# Altium project uStepperS.PrjPcb
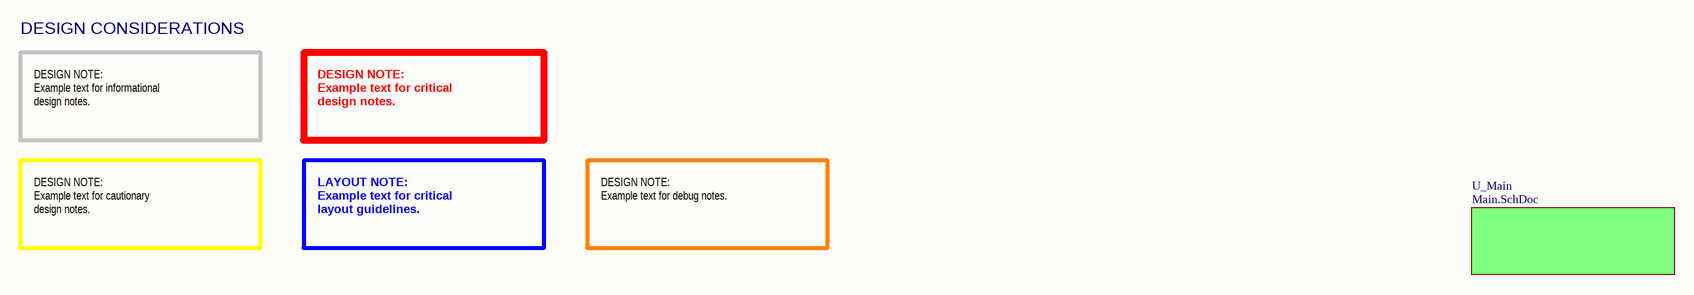
[diagram p0: Coverpage.SchDoc]
GlobalCompanyName: ON Development; GlobalDrawnBy: Mogens Groth Nicolaisen; GlobalProjectName: uStepper S; GlobalProjectRevision: 1.0
7 sheets, 108 parts. Net scope: hierarchical (ports join the sheet entries above them; power ports are global).
Board file: uStepper.PcbDoc
Sheets:
  Coverpage.SchDoc
    U_Main = Main.SchDoc
      U_encoder = encoder.SchDoc
      U_Power = Power.SchDoc
      U_Stepper_control = Stepper_control.SchDoc
      U_USB = USB.SchDoc
      U_MCU+IO = MCU+IO.SchDoc

## Sheet Coverpage.SchDoc: uStepper S
size A3; DrawnBy: Mogens Groth Nicolaisen; DocumentNumber: 1; SheetNumber: 1; SheetTotal: 7

### Sub-sheets
U_Main = Main.SchDoc: no entries

### Notes on the sheet
- DESIGN CONSIDERATIONS
- DESIGN NOTE:
  Example text for informational
  design notes.
- DESIGN NOTE:
  Example text for critical
  design notes.
- DESIGN NOTE:
  Example text for cautionary
  design notes.
- LAYOUT NOTE:
  Example text for critical
  layout guidelines.
- DESIGN NOTE:
  Example text for debug notes.
- ON Development
- Title:
- Size:
- A3
- Drawn By:
- Date:
- Sheet
- of
- Revision:

## Sheet Main.SchDoc: Main
size A3; DrawnBy: Mogens Groth Nicolaisen; DocumentNumber: 2; Revision: 1.0; SheetNumber: 2; SheetTotal: 7
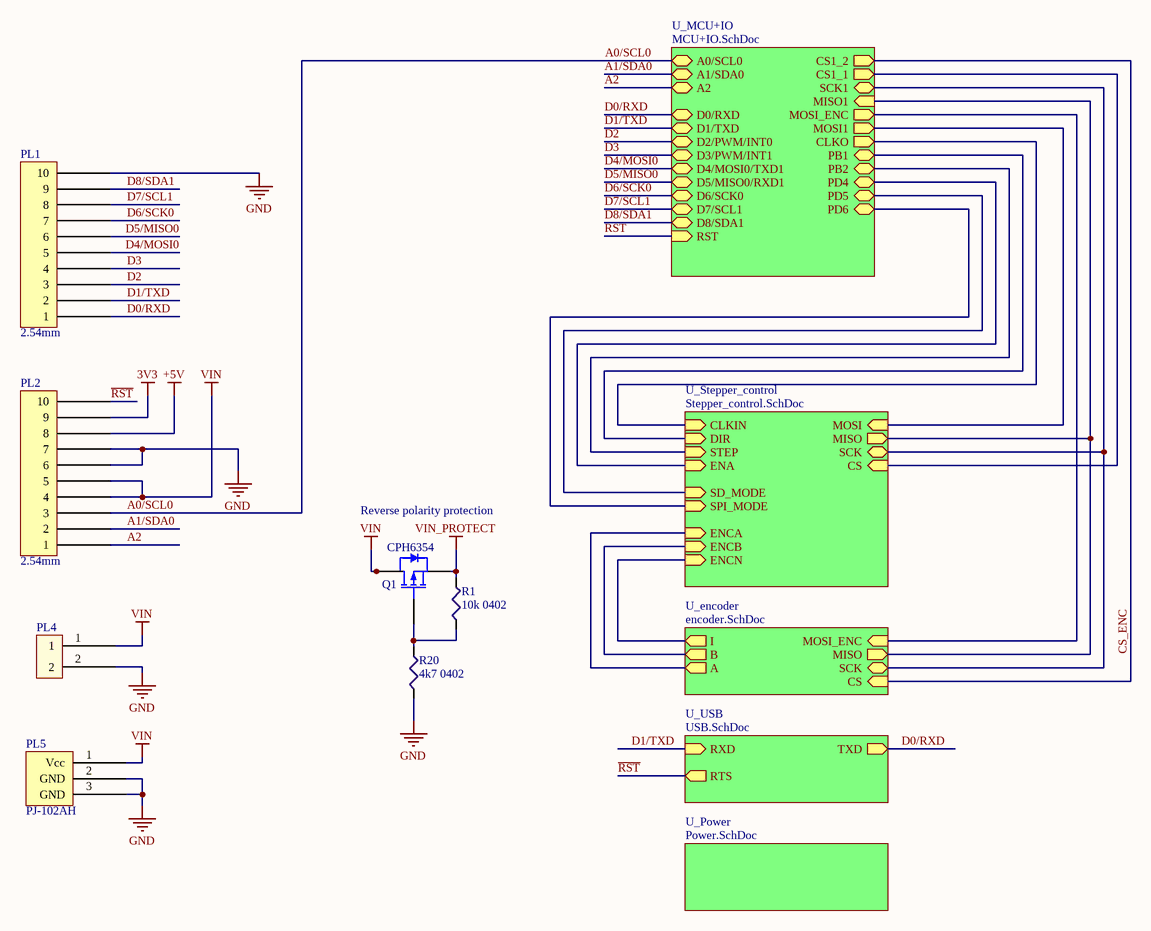
[diagram p1: Main.SchDoc]

### Parts
PL1  2.54mm  [10-pin female 2.54mm]
PL2  2.54mm  [10-pin female 2.54mm]
PL4  2pin Terminal block 5.08mm  [5mm header]  (value not drawn)
PL5  PJ-102AH  [PJ-102AH]
Q1  CPH6354  [SOT95P280X95-6N]
R1  10k 0402  [RES_0402]
R20  4k7 0402  [RES_0402]

### Sub-sheets
U_encoder = encoder.SchDoc: MISO (out), MOSI_ENC (in), SCK (bidir), CS (in), A (out), B (out), I (out)
U_MCU+IO = MCU+IO.SchDoc: A0/SCL0 (bidir), A1/SDA0 (bidir), A2 (bidir), MOSI_ENC (out), D1/TXD (bidir), D0/RXD (bidir), PB2 (bidir), D4/MOSI0/TXD1 (bidir), D5/MISO0/RXD1 (bidir), D6/SCK0 (bidir), SCK1 (bidir), MISO1 (in), MOSI1 (out), CS1_1 (out), CLKO (out), D8/SDA1 (bidir), D7/SCL1 (bidir), D3/PWM/INT1 (bidir), D2/PWM/INT0 (bidir), PD5 (bidir), PD6 (bidir), PD4 (bidir), PB1 (bidir), CS1_2 (out), RST (in)
U_Power = Power.SchDoc: no entries
U_Stepper_control = Stepper_control.SchDoc: STEP (in), DIR (in), CS (in), SCK (bidir), MOSI (in), MISO (out), ENCN (in), ENCA (in), ENCB (in), SPI_MODE (in), SD_MODE (in), ENA (in), CLKIN (in)
U_USB = USB.SchDoc: RXD (in), TXD (out), RTS (out)

### Nets
3V3: PL2.9
+5V: PL2.8
GND: PL1.10 PL2.6 PL2.7 PL4.2 PL5.2(GND) PL5.3(GND) R20.1
VIN: PL2.4 PL2.5 PL4.1 PL5.1(Vcc) Q1.1(DRAIN) Q1.2(DRAIN) Q1.5(DRAIN) Q1.6(DRAIN)
VIN_PROTECT: Q1.4(SOURCE) R1.2
~{RST}: PL2.10 ; sheet U_USB/RTS, sheet U_MCU+IO/RST
A: sheet U_encoder/A, sheet U_Stepper_control/ENCA
A0/SCL0: PL2.3 ; sheet U_MCU+IO/A0/SCL0
A1/SDA0: PL2.2 ; sheet U_MCU+IO/A1/SDA0
A2: PL2.1 ; sheet U_MCU+IO/A2
B: sheet U_encoder/B, sheet U_Stepper_control/ENCB
CLKIN: sheet U_Stepper_control/CLKIN, sheet U_MCU+IO/CLKO
CS: sheet U_Stepper_control/CS, sheet U_MCU+IO/CS1_1
CS_ENC: sheet U_encoder/CS, sheet U_MCU+IO/CS1_2
D0/RXD: PL1.1 ; sheet U_USB/TXD, sheet U_MCU+IO/D0/RXD
D1/TXD: PL1.2 ; sheet U_USB/RXD, sheet U_MCU+IO/D1/TXD
D2: PL1.3 ; sheet U_MCU+IO/D2/PWM/INT0
D3: PL1.4 ; sheet U_MCU+IO/D3/PWM/INT1
D4/MOSI0: PL1.5 ; sheet U_MCU+IO/D4/MOSI0/TXD1
D5/MISO0: PL1.6 ; sheet U_MCU+IO/D5/MISO0/RXD1
D6/SCK0: PL1.7 ; sheet U_MCU+IO/D6/SCK0
D7/SCL1: PL1.8 ; sheet U_MCU+IO/D7/SCL1
D8/SDA1: PL1.9 ; sheet U_MCU+IO/D8/SDA1
DIR: sheet U_Stepper_control/DIR, sheet U_MCU+IO/PB1
ENA: sheet U_Stepper_control/ENA, sheet U_MCU+IO/PD4
ENCN: sheet U_encoder/I, sheet U_Stepper_control/ENCN
MISO: sheet U_encoder/MISO, sheet U_Stepper_control/MISO, sheet U_MCU+IO/MISO1
MOSI: sheet U_Stepper_control/MOSI, sheet U_MCU+IO/MOSI1
MOSI_ENC: sheet U_encoder/MOSI_ENC, sheet U_MCU+IO/MOSI_ENC
PB2: sheet U_Stepper_control/STEP, sheet U_MCU+IO/PB2
PD5: sheet U_Stepper_control/SD_MODE, sheet U_MCU+IO/PD5
PD6: sheet U_Stepper_control/SPI_MODE, sheet U_MCU+IO/PD6
SCK: sheet U_encoder/SCK, sheet U_Stepper_control/SCK, sheet U_MCU+IO/SCK1
NetQ1_3: Q1.3(GATE) R1.1 R20.2

### Notes on the sheet
- Reverse polarity protection
- ON Development
- Title:
- Size:
- A3
- Drawn By:
- Date:
- Sheet
- of
- Revision:

### Library data of the parts
PL1 PL2 = CMP-003-0004-2: Pin header 10-pin 2.54mm female; Mfg. Part Number: DS1023-1*10S21
PL4 = CMP-003-0002-2: PCB terminal block, angled 90°; 5mm, 2-way, 1.5mm2; Mfg. Part Number: DG301-5.0-02P-11-00A(H)
PL5 = CMP-003-0001-3: CONN PWR JACK 2X5.5MM SOLDER; Mfg. Part Number: PJ-102AH
Q1 = CMP-014-0006-2: MOSFET P-CH 60V 4A CPH6; Mfg. Part Number: CPH6354-TL-W
R1 = CMP-001-0019-3: RES SMD 10K OHM 1% 1/16W 0402; Mfg. Part Number: RMCF0402FT10K0; Case/Package: 0402; Power: 1/16 W; Tolerance: 1 %; Value: 10k
R20 = CMP-001-0029-3: RES SMD 4.7K OHM 1% 1/16W 0402; Mfg. Part Number: RC1005F472CS; Tolerance: 1; Case/Package: 0402; Power: 1/16W; Value: 4k7

## Sheet encoder.SchDoc: Encoder
size A3; DrawnBy: Mogens Groth Nicolaisen; DocumentNumber: 7; Revision: 1.0; SheetNumber: 7; SheetTotal: 7
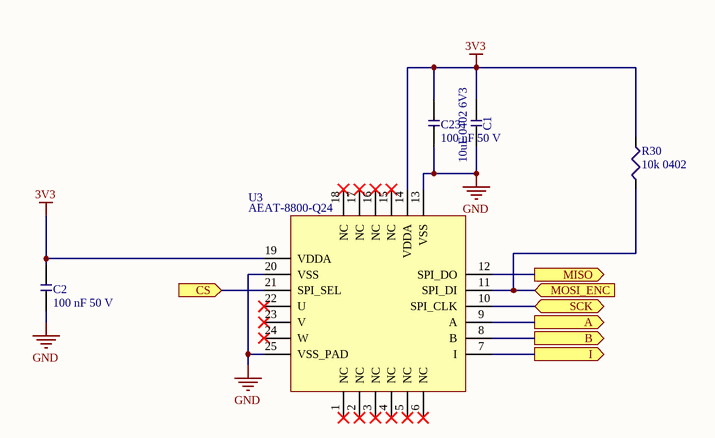
[diagram p2: encoder.SchDoc]

### Parts
C1  10uF 0402 6V3  [CAP_0402]
C2  100 nF 50 V  [CAP_0402]
C23  100 nF 50 V  [CAP_0402]
R30  10k 0402  [RES_0402]
U3  AEAT-8800-Q24  [AEAT-8800-Q24]

### Ports
A (out), B (out), CS (in), I (out), MISO (out), MOSI_ENC (in), SCK (bidir)

### Nets
3V3: C1.2 C2.1 C23.1 R30.2 U3.14(VDDA) U3.19(VDDA)
GND: C1.1 C2.2 C23.2 U3.13(VSS) U3.20(VSS) U3.25(VSS_PAD)
A: U3.9(A) ; port A
B: U3.8(B) ; port B
CS_ENC: U3.21(SPI_SEL) ; port CS
ENCN: U3.7(I) ; port I
MISO: U3.12(SPI_DO) ; port MISO
MOSI_ENC: R30.1 U3.11(SPI_DI) ; port MOSI_ENC
SCK: U3.10(SPI_CLK) ; port SCK

Not connected (* = marked no-connect by the designer): U3 1(NC)* 2(NC)* 3(NC)* 4(NC)* 5(NC)* 6(NC)* 15(NC)* 16(NC)* 17(NC)* 18(NC)* 22(U)* 23(V)* 24(W)*

### Notes on the sheet
- ON Development
- Title:
- Size:
- A3
- Drawn By:
- Date:
- Sheet
- of
- Revision:

### Library data of the parts
C1 = CMP-00011-3: 10uF 20% 0402 6V3 X6S; Current Rating: -; Tolerance: 20%; Value: 10uF; Voltage: 6V3
C2 C23 = CMP-00088-2: Multilayer Ceramic Capacitors MLCC - SMD/SMT .1uF 50Volts X7R +/-10% 0402 STD; Tolerance: 10%; Value: 100nF; Voltage: 50 V; Voltage Rating (DC): 50V; Capacitance: 100nF; Case/Package: 0402; Case Code (Imperial): 0402; Case Code (Metric): 1005; Dielectric: X7R; Halogen Free: Halogen Free; Height: 0.5mm; Lead Free: Lead Free; Length: 0.039inch; Max Operating Temperature: 125°C; Min Operating Temperature: -55°C; Mount: Surface Mount; Package Quantity: 10000; Packaging: Tape and Reel; Termination: SMD/SMT; Thickness: 0.022inch; Voltage Rating: 50V; Width: 0.5mm
R30 = CMP-001-0019-3: as R1 on sheet Main; Case/Package: 0402; Power: 1/16 W; Tolerance: 1 %; Value: 10k
U3 = CMP-00040-3: 16-BIT PROG ANG ENCODER; Mfg. Part Number: AEAT-8800-Q24

## Sheet Power.SchDoc: Power
size A3; DrawnBy: Mogens Groth Nicolaisen; DocumentNumber: 5; Revision: 1.0; SheetNumber: 5; SheetTotal: 7
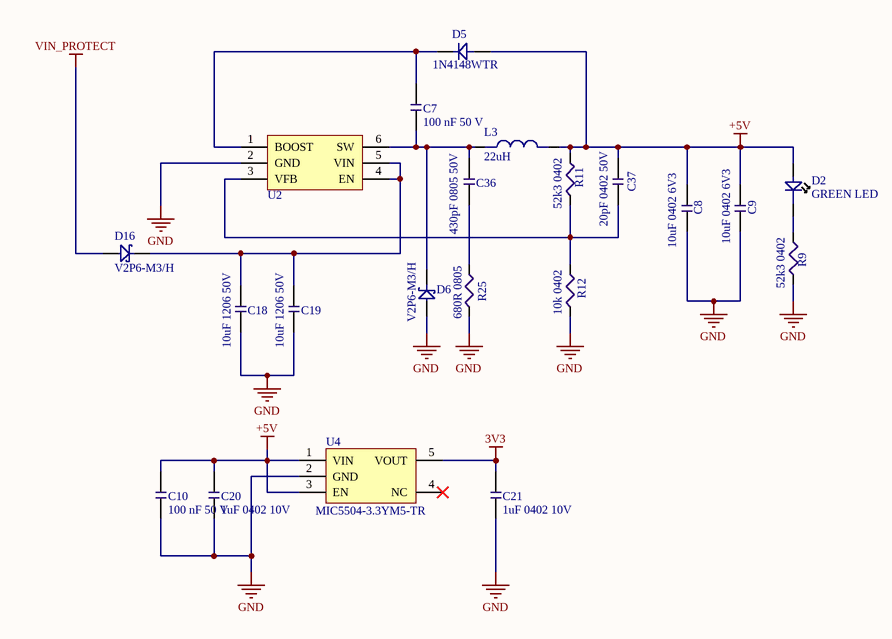
[diagram p3: Power.SchDoc]

### Parts
C7  100 nF 50 V  [CAP_0402]
C8  10uF 0402 6V3  [CAP_0402]
C9  10uF 0402 6V3  [CAP_0402]
C10  100 nF 50 V  [CAP_0402]
C18  10uF 1206 50V  [CAP_1206]
C19  10uF 1206 50V  [CAP_1206]
C20  1uF 0402 10V  [CAP_0402]
C21  1uF 0402 10V  [CAP_0402]
C36  430pF 0805 50V  [CAP_0805]
C37  20pF 0402 50V  [CAP_0402]
D2  GREEN LED  [0402 LED]
D5  1N4148WTR  [SODFL371X135-2N]
D6  V2P6-M3/H  [MicroSMP]
D16  V2P6-M3/H  [MicroSMP]
L3  22uH  [NR6028T220M]
R9  52k3 0402  [RES_0402]
R11  52k3 0402  [RES_0402]
R12  10k 0402  [RES_0402]
R25  680R 0805  [RES_0805]
U2  MCP16331  [SOT95P280X145-6N]  (value not drawn)
U4  MIC5504-3.3YM5-TR  [SOT95P280X130-5N]

### Nets
3V3: C21.2 U4.5(VOUT)
+5V: C8.2 C9.2 C10.1 C20.2 C37.1 D2.1 D5.1 L3.2 R11.2 U4.1(VIN) U4.3(EN)
GND: C8.1 C9.1 C10.2 C18.1 C19.1 C20.1 C21.1 D6.1 R9.1 R12.1 R25.1 U2.2(GND) U4.2(GND)
VIN_PROTECT: D16.1
NetC7_1: C7.1 D5.2 U2.1(BOOST)
NetC7_2: C7.2 C36.1 D6.2 L3.1 U2.6(SW)
NetC18_2: C18.2 C19.2 D16.2 U2.4(EN) U2.5(VIN)
NetC36_2: C36.2 R25.2
NetC37_2: C37.2 R11.1 R12.2 U2.3(VFB)
NetD2_2: D2.2 R9.2

Not connected (* = marked no-connect by the designer): U4 4(NC)*

### Notes on the sheet
- ON Development
- Title:
- Size:
- A3
- Drawn By:
- Date:
- Sheet
- of
- Revision:

### Library data of the parts
C7 C10 = CMP-00088-2: as C2 on sheet encoder; Capacitance: 100nF; Case/Package: 0402; Case Code (Imperial): 0402; Case Code (Metric): 1005; Dielectric: X7R; Halogen Free: Halogen Free; Height: 0.5mm; Lead Free: Lead Free; Length: 0.039inch; Max Operating Temperature: 125°C; Min Operating Temperature: -55°C; Mount: Surface Mount; Package Quantity: 10000; Packaging: Tape and Reel; Termination: SMD/SMT; Thickness: 0.022inch; Voltage Rating: 50V; Width: 0.5mm
C8 C9 = CMP-00011-3: 10uF 20% 0402 6V3 X6S; Current Rating: -; Tolerance: 20%; Value: 10uF; Voltage: 6V3
C18 C19 = CMP-00030-4: 10uF 1206 50V X5R 20%; Tolerance: +/- 20%; Value: 10uF; Voltage: 50 V
C20 C21 = CMP-00032-5: 1uF 0402 10V 10% X5R; Material: Ceramic; Tolerance: 10%; Value: 1 uF; Voltage: 10 V; Capacitance: 1uF; Case/Package: 0402; Case Code (Imperial): 0402; Case Code (Metric): 1005; Contact Plating: Tin; Depth: 0.5mm; Dielectric: X5R; Height: 0.5mm; Length: 1mm; Max Operating Temperature: 85°C; Min Operating Temperature: -55°C; Mount: Surface Mount; Package Quantity: 1; Packaging: Tape and Reel; Radiation Hardening: No; Thickness: 0.022inch; Voltage Rating: 10V; Width: 0.02inch
C36 = CMP-00058-4: CAP CER 430PF 50V C0G/NP0 0805; Mfg. Part Number: CL21C431JBANNNC; Tolerance: 5%; Value: 430pF; Voltage: 50V
C37 = CMP-00049-4: 20pF 0402 50V C0G 5%; Mfg. Part Number: GRM1555C1H200JA01D; Tolerance: 5%; Value: 20pF; Voltage: 50 V
D2 = CMP-008-0001-2: 0402 SMD LED; Mfg. Part Number: LTST-C281KGKT
D5 = CMP-016-0003-2: DIODE GEN PURP 75V 250MA SOD123
D6 D16 = CMP-016-0002-2: DIODE SCHOTTKY 60V 2A MICROSMP
L3 = CMP-007-0002-3: FIXED IND 22UH 1.4A 175.5 MOHM; FootprintName1: NR6028T220M; FootprintRevisionID1: PCC-0032-1; Value: 22 uH; Case/Package: -; Current: 1.4 A; Mfg. Part Number: NR6028T220M
R9 R11 = CMP-001-0018-3: RES SMD 52.3K OHM 1% 1/16W 0402; Mfg. Part Number: RC0402FR-0752K3L; Case/Package: 0402; Power: 1/16 W; Tolerance: 1 %; Value: 52k3
R12 = CMP-001-0019-3: as R1 on sheet Main; Case/Package: 0402; Power: 1/16 W; Tolerance: 1 %; Value: 10k
R25 = CMP-001-0036-3: RES SMD 680 OHM 1% 1/8W 0805; Mfg. Part Number: RC0805FR-07680RL; Case/Package: 0805; Power: 1/8W; Tolerance: 1%; Value: 680R
U2 = CMP-00029-4: High-Voltage Input Integrated Switch Step-Down Regulator
U4 = CMP-00031-4: LDO Voltage Regulators Single 300mA

## Sheet Stepper_control.SchDoc: Stepper Control
size A3; DrawnBy: Mogens Groth Nicolaisen; DocumentNumber: 4; Revision: 1.0; SheetNumber: 4; SheetTotal: 7
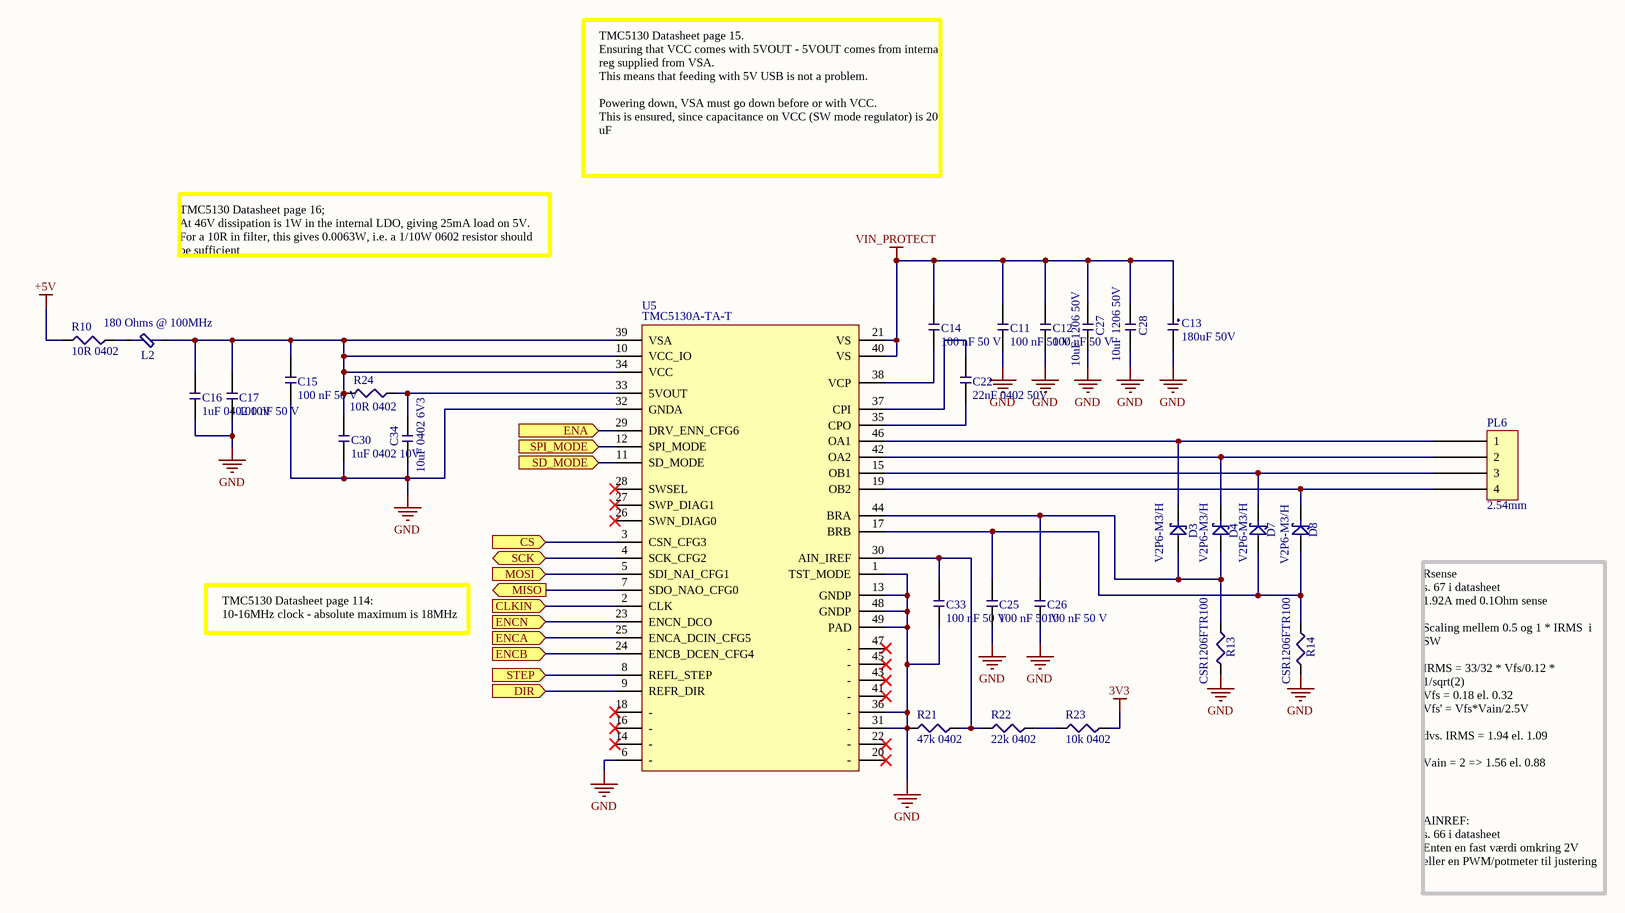
[diagram p4: Stepper_control.SchDoc]

### Parts
C11  100 nF 50 V  [CAP_0402]
C12  100 nF 50 V  [CAP_0402]
C13  180uF 50V  [Capacitor 8x22]
C14  100 nF 50 V  [CAP_0402]
C15  100 nF 50 V  [CAP_0402]
C16  1uF 0402 10V  [CAP_0402]
C17  100 nF 50 V  [CAP_0402]
C22  22nF 0402 50V  [CAP_0402]
C25  100 nF 50 V  [CAP_0402]
C26  100 nF 50 V  [CAP_0402]
C27  10uF 1206 50V  [CAP_1206]
C28  10uF 1206 50V  [CAP_1206]
C30  1uF 0402 10V  [CAP_0402]
C33  100 nF 50 V  [CAP_0402]
C34  10uF 0402 6V3  [CAP_0402]
D3  V2P6-M3/H  [MicroSMP]
D4  V2P6-M3/H  [MicroSMP]
D7  V2P6-M3/H  [MicroSMP]
D8  V2P6-M3/H  [MicroSMP]
L2  180 Ohms @ 100MHz  [IND_0603]
PL6  2.54mm  [4-pin 2.54mm header]
R10  10R 0402  [RES_0402]
R13  CSR1206FTR100  [RES_1206]
R14  CSR1206FTR100  [RES_1206]
R21  47k 0402  [RES_0402]
R22  22k 0402  [RES_0402]
R23  10k 0402  [RES_0402]
R24  10R 0402  [RES_0402]
U5  TMC5130A-TA-T  [TSQFP50P900X900X120_HS-49N]

### Ports
CLKIN (in), CS (in), DIR (in), ENA (in), ENCA (in), ENCB (in), ENCN (in), MISO (out), MOSI (in), SCK (bidir), SD_MODE (in), SPI_MODE (in), STEP (in)

### Nets
3V3: R23.1
+5V: R10.2
GND: C11.2 C12.2 C13.2 C15.2 C16.1 C17.2 C25.2 C26.2 C27.2 C28.2 C30.1 C33.2 C34.1 R13.1 R14.1 R21.2 U5.1(TST_MODE) U5.6(-) U5.13(GNDP) U5.31(-) U5.32(GNDA) U5.36(-) U5.48(GNDP) U5.49(PAD)
VIN_PROTECT: C11.1 C12.1 C13.1 C14.2 C27.1 C28.1 U5.21(VS) U5.40(VS)
A: U5.25(ENCA_DCIN_CFG5) ; port ENCA
B: U5.24(ENCB_DCEN_CFG4) ; port ENCB
CLKIN: U5.2(CLK) ; port CLKIN
CS: U5.3(CSN_CFG3) ; port CS
DIR: U5.9(REFR_DIR) ; port DIR
ENA: U5.29(DRV_ENN_CFG6) ; port ENA
ENCN: U5.23(ENCN_DCO) ; port ENCN
MISO: U5.7(SDO_NAO_CFG0) ; port MISO
MOSI: U5.5(SDI_NAI_CFG1) ; port MOSI
PB2: U5.8(REFL_STEP) ; port STEP
PD5: U5.11(SD_MODE) ; port SD_MODE
PD6: U5.12(SPI_MODE) ; port SPI_MODE
SCK: U5.4(SCK_CFG2) ; port SCK
NetC14_1: C14.1 U5.38(VCP)
NetC15_1: C15.1 C16.2 C17.1 C30.2 L2.2 R24.1 U5.10(VCC_IO) U5.34(VCC) U5.39(VSA)
NetC22_1: C22.1 U5.35(CPO)
NetC22_2: C22.2 U5.37(CPI)
NetC25_1: C25.1 D7.1 D8.1 R14.2 U5.17(BRB)
NetC26_1: C26.1 D3.1 D4.1 R13.2 U5.44(BRA)
NetC33_1: C33.1 R21.1 R22.1 U5.30(AIN_IREF)
NetC34_2: C34.2 R24.2 U5.33(5VOUT)
NetD3_2: D3.2 PL6.1 U5.46(OA1)
NetD4_2: D4.2 PL6.2 U5.42(OA2)
NetD7_2: D7.2 PL6.3 U5.15(OB1)
NetD8_2: D8.2 PL6.4 U5.19(OB2)
NetL2_1: L2.1 R10.1
NetR22_2: R22.2 R23.2

Not connected (* = marked no-connect by the designer): U5 14(-)* 16(-)* 18(-)* 20(-)* 22(-)* 26(SWN_DIAG0)* 27(SWP_DIAG1)* 28(SWSEL)* 41(-)* 43(-)* 45(-)* 47(-)*

### Notes on the sheet
- TMC5130 Datasheet page 15.
  Ensuring that VCC comes with 5VOUT - 5VOUT comes from internal reg supplied from VSA.
  This means that feeding with 5V USB is not a problem.
  Powering down, VSA must go down before or with VCC.
  This is ensured, since capacitance on VCC (SW mode regulator) is 20 uF
- TMC5130 Datasheet page 16;
  At 46V dissipation is 1W in the internal LDO, giving 25mA load on 5V.
  For a 10R in filter, this gives 0.0063W, i.e. a 1/10W 0602 resistor should be sufficient
- TMC5130 Datasheet page 114:
  10-16MHz clock - absolute maximum is 18MHz
- Rsense
  s. 67 i datasheet
  1.92A med 0.1Ohm sense
  Scaling mellem 0.5 og 1 * IRMS  i SW
  IRMS = 33/32 * Vfs/0.12 * 1/sqrt(2)
  Vfs = 0.18 el. 0.32
  Vfs' = Vfs*Vain/2.5V
  dvs. IRMS = 1.94 el. 1.09
  Vain = 2 => 1.56 el. 0.88
- AINREF:
  s. 66 i datasheet
  Enten en fast værdi omkring 2V eller en PWM/potmeter til justering
- ON Development
- Title:
- Size:
- A3
- Drawn By:
- Date:
- Sheet
- of
- Revision:

### Library data of the parts
C11 C12 C14 C15 C17 C33 = CMP-00088-2: Multilayer Ceramic Capacitors MLCC - SMD/SMT .1uF 50Volts X7R +/-10% 0402 STD; Tolerance: 10%; Value: 100nF; Voltage: 50 V; Voltage Rating: 50V; Mount: Surface Mount; Case/Package: 0402; Case Code (Imperial): 0402; Case Code (Metric): 1005; Min Operating Temperature: -55°C; Max Operating Temperature: 125°C; Capacitance: 100nF; Voltage Rating (DC): 50V; Packaging: Tape and Reel; Package Quantity: 10000; Dielectric: X7R; Termination: SMD/SMT; Length: 0.039inch; Height: 0.5mm; Width: 0.5mm; Thickness: 0.022inch; Lead Free: Lead Free; Halogen Free: Halogen Free
C13 = CMP-002-0003-4: 180UF 20% 50V 105DEG RADIAL; Case/Package: -; Tolerance: 20%; Value: 180uF
C16 C30 = CMP-00032-5: 1uF 0402 10V 10% X5R; Material: Ceramic; Tolerance: 10%; Value: 1 uF; Voltage: 10 V; Capacitance: 1uF; Case/Package: 0402; Case Code (Imperial): 0402; Case Code (Metric): 1005; Contact Plating: Tin; Depth: 0.5mm; Dielectric: X5R; Height: 0.5mm; Length: 1mm; Max Operating Temperature: 85°C; Min Operating Temperature: -55°C; Mount: Surface Mount; Package Quantity: 1; Packaging: Tape and Reel; Radiation Hardening: No; Thickness: 0.022inch; Voltage Rating: 10V; Width: 0.02inch
C22 = CMP-00045-5: 22nF 0402 50V X7R 10%; Mfg. Part Number: GRM155R71H223KA12D; Tolerance: 10%; Value: 22nF; Voltage: 50V
C25 C26 = CMP-00088-2: as C2 on sheet encoder; Capacitance: 100nF; Case/Package: 0402; Case Code (Imperial): 0402; Case Code (Metric): 1005; Dielectric: X7R; Halogen Free: Halogen Free; Height: 0.5mm; Lead Free: Lead Free; Length: 0.039inch; Max Operating Temperature: 125°C; Min Operating Temperature: -55°C; Mount: Surface Mount; Package Quantity: 10000; Packaging: Tape and Reel; Termination: SMD/SMT; Thickness: 0.022inch; Voltage Rating: 50V; Width: 0.5mm
C27 C28 = CMP-00030-4: as C18 on sheet Power; Value: 10uF; Voltage: 50 V
C34 = CMP-00011-3: 10uF 20% 0402 6V3 X6S; Current Rating: -; Tolerance: 20%; Value: 10uF; Voltage: 6V3
D3 D4 D7 D8 = CMP-016-0002-2: DIODE SCHOTTKY 60V 2A MICROSMP
L2 = CMP-ROOT-0005-2: FERRITE BEAD 180 OHM 0603 1LN; Mfg. Part Number: BLM18PG181SN1D; Current: 1.5A; Value: 180 Ohm; Case/Package: 0603
PL6 = CMP-003-0003-3: Pin header 4-pin 2.54mm male; Mfg. Part Number: DS1021-1*4SF1-1
R10 R24 = CMP-001-0033-3: RES SMD 10 OHM 1% 1/16W 0402; Mfg. Part Number: 0402WGF100JTCE; Power: 63mW; Case/Package: 0402; Tolerance: 1%; Value: 10R
R13 R14 = CMP-001-0024-3: RES 0.1 OHM 1% 1/2W 1206; Power: 0.5W; Value: 0R1; Case/Package: 1206; Tolerance: 1%; Mfg. Part Number: CSR1206FTR100
R21 = CMP-001-0027-3: RES SMD 47K OHM 1% 1/16W 0402; Mfg. Part Number: RMCF0402FT47K0; Case/Package: 0402; Power: 1/16W; Tolerance: 1%; Value: 47k
R22 = CMP-001-0026-3: RES SMD 22K OHM 1% 1/16W 0402; Mfg. Part Number: RMCF0402FT22K0; Case/Package: 0402; Power: 1/16W; Tolerance: 1%; Value: 22k
R23 = CMP-001-0019-3: as R1 on sheet Main; Case/Package: 0402; Power: 1/16 W; Tolerance: 1 %; Value: 10k
U5 = CMP-00034-3: IC MOTOR CTLR/DVR SPI 48QFP; Mfg. Part Number: TMC5130A-TA-T

## Sheet USB.SchDoc: USB interface
size A3; DrawnBy: Mogens Groth Nicolaisen; DocumentNumber: 6; Revision: 1.0; SheetNumber: 6; SheetTotal: 7
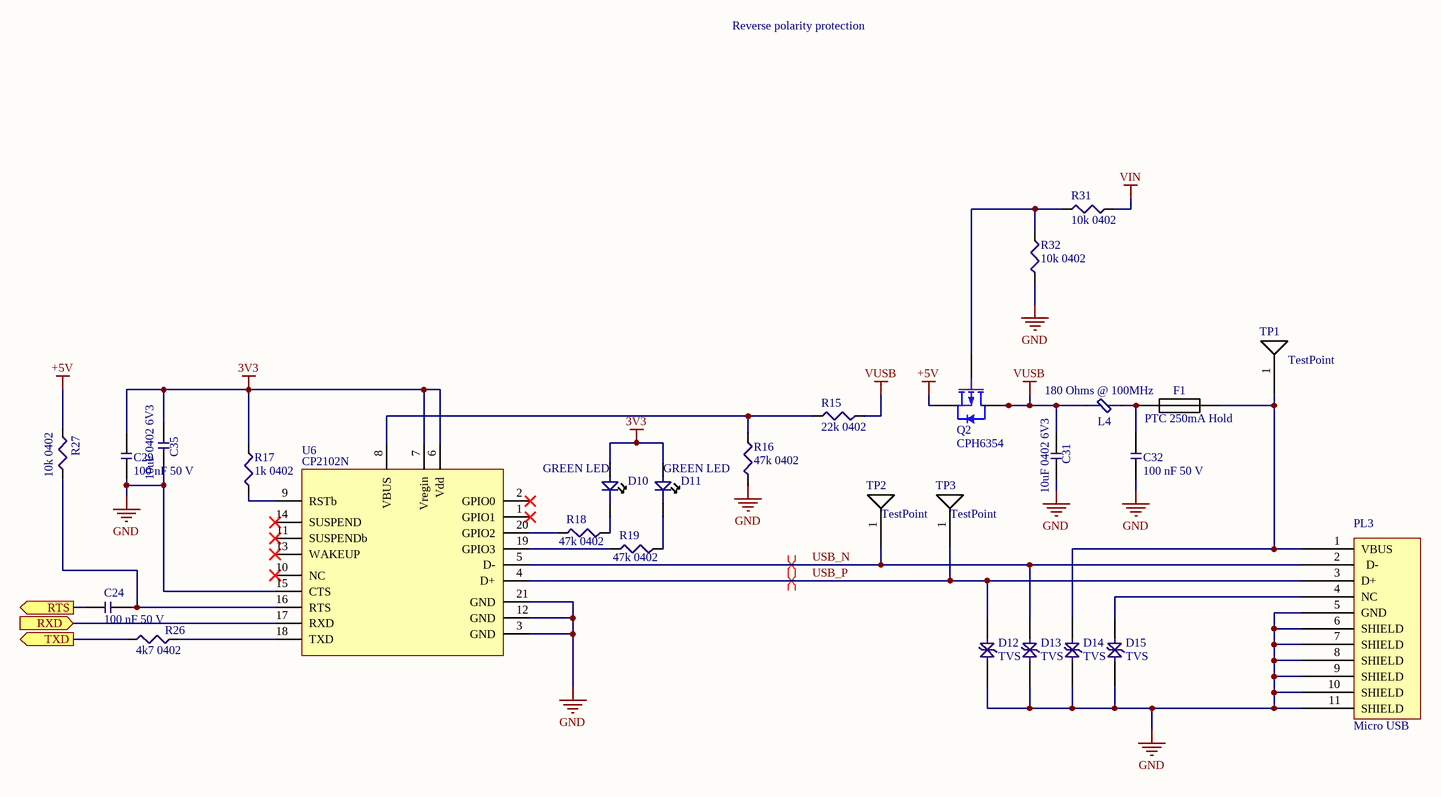
[diagram p5: USB.SchDoc]

### Parts
C24  100 nF 50 V  [CAP_0402]
C29  100 nF 50 V  [CAP_0402]
C31  10uF 0402 6V3  [CAP_0402]
C32  100 nF 50 V  [CAP_0402]
C35  10uF 0402 6V3  [CAP_0402]
D10  GREEN LED  [0402 LED]
D11  GREEN LED  [0402 LED]
D12  TVS  [RES_0402]
D13  TVS  [RES_0402]
D14  TVS  [RES_0402]
D15  TVS  [RES_0402]
F1  PTC 250mA Hold  [PTC Fuse 1206]
L4  180 Ohms @ 100MHz  [IND_0603]
PL3  Micro USB  [10118193-0001LF Micro USB]
Q2  CPH6354  [SOT95P280X95-6N]
R15  22k 0402  [RES_0402]
R16  47k 0402  [RES_0402]
R17  1k 0402  [RES_0402]
R18  47k 0402  [RES_0402]
R19  47k 0402  [RES_0402]
R26  4k7 0402  [RES_0402]
R27  10k 0402  [RES_0402]
R31  10k 0402  [RES_0402]
R32  10k 0402  [RES_0402]
TP1  TestPoint  [1x0mm]  (no BOM)
TP2  TestPoint  [1x0mm]  (no BOM)
TP3  TestPoint  [1x0mm]  (no BOM)
U6  CP2102N  [QFN50P300X300X80_HS-21N]

### Ports
RTS (out), RXD (in), TXD (out)

### Nets
3V3: C29.1 C35.2 D10.1 D11.1 R17.2 U6.6(Vdd) U6.7(Vregin)
+5V: Q2.4(SOURCE) R27.2
GND: C29.2 C31.1 C32.2 C35.1 D12.1(Anode) D13.1(Anode) D14.1(Anode) D15.1(Anode) PL3.5(GND) PL3.6(SHIELD) PL3.7(SHIELD) PL3.8(SHIELD) PL3.9(SHIELD) PL3.10(SHIELD) PL3.11(SHIELD) R16.1 R32.2 U6.3(GND) U6.12(GND) U6.15(CTS) U6.21(GND)
VIN: R31.1
VUSB: C31.2 L4.1 Q2.1(DRAIN) Q2.2(DRAIN) Q2.5(DRAIN) Q2.6(DRAIN) R15.2
~{RST}: C24.1 ; port RTS
D0/RXD: R26.2 ; port TXD
D1/TXD: U6.17(RXD) ; port RXD
USB_N: D13.2(Cathode) PL3.2(D-) TP2.1 U6.5(D-)
USB_P: D12.2(Cathode) PL3.3(D+) TP3.1 U6.4(D+)
NetC24_2: C24.2 R27.1 U6.16(RTS)
NetC32_1: C32.1 F1.1 L4.2
NetD10_2: D10.2 R18.1
NetD11_2: D11.2 R19.1
NetD14_2: D14.2(Cathode) F1.2 PL3.1(VBUS) TP1.1
NetD15_2: D15.2(Cathode) PL3.4(NC)
NetQ2_3: Q2.3(GATE) R31.2 R32.1
NetR15_1: R15.1 R16.2 U6.8(VBUS)
NetR17_1: R17.1 U6.9(RSTb)
NetR18_2: R18.2 U6.20(GPIO2)
NetR19_2: R19.2 U6.19(GPIO3)
NetR26_1: R26.1 U6.18(TXD)

Not connected (* = marked no-connect by the designer): U6 1(GPIO1)* 2(GPIO0)* 10(NC)* 11(SUSPENDb)* 13(WAKEUP)* 14(SUSPEND)*

### Layout directives
differential pair: USB_N, USB_P

### Notes on the sheet
- Reverse polarity protection
- ON Development
- Title:
- Size:
- A3
- Drawn By:
- Date:
- Sheet
- of
- Revision:

### Library data of the parts
C24 C29 C32 = CMP-00088-2: as C2 on sheet encoder; Capacitance: 100nF; Case/Package: 0402; Case Code (Imperial): 0402; Case Code (Metric): 1005; Dielectric: X7R; Halogen Free: Halogen Free; Height: 0.5mm; Lead Free: Lead Free; Length: 0.039inch; Max Operating Temperature: 125°C; Min Operating Temperature: -55°C; Mount: Surface Mount; Package Quantity: 10000; Packaging: Tape and Reel; Termination: SMD/SMT; Thickness: 0.022inch; Voltage Rating: 50V; Width: 0.5mm
C31 C35 = CMP-00011-3: 10uF 20% 0402 6V3 X6S; Current Rating: -; Tolerance: 20%; Value: 10uF; Voltage: 6V3
D10 D11 = CMP-008-0001-2: as D2 on sheet Power
D12-D15 = CMP-016-0004-2: TVS DIODE 12VC 8A IPP 0402; Mfg. Part Number: GG040205100N2P
F1 = CMP-017-0000-3: PTC RESET FUSE 24V 250MA 1206; Mfg. Part Number: 0ZCJ0025AF2E; Case/Package: 1206; Mount: SMD; Pins: 2; RoHS: Yes
L4 = CMP-ROOT-0005-2: as L2 on sheet Stepper_control; Case/Package: 0603
PL3 = CMP-003-0000-3: CONN USB MICRO B RECPT SMT R/A; Mfg. Part Number: 10118193-0001LF
Q2 = CMP-014-0006-2: as Q1 on sheet Main
R15 = CMP-001-0026-3: as R22 on sheet Stepper_control; Case/Package: 0402; Power: 1/16W; Tolerance: 1%; Value: 22k
R16 R18 R19 = CMP-001-0027-3: as R21 on sheet Stepper_control; Case/Package: 0402; Power: 1/16W; Tolerance: 1%; Value: 47k
R17 = CMP-001-0025-3: RES SMD 1K OHM 1% 1/16W 0402; Mfg. Part Number: CRG0402F1K0; Case/Package: 0402; Power: 1/16W; Tolerance: 1%; Value: 1k
R26 = CMP-001-0029-3: as R20 on sheet Main; Case/Package: 0402; Power: 1/16W; Value: 4k7
R27 R31 R32 = CMP-001-0019-3: as R1 on sheet Main; Case/Package: 0402; Power: 1/16 W; Tolerance: 1 %; Value: 10k
TP1-TP3 = CMP-ROOT-0006-0.0
U6 = CMP-00038-5: IC BRIDGE USB TO UART 20QFN; Mfg. Part Number: CP2102N-A01-GQFN20

## Sheet MCU+IO.SchDoc: MCU
size A3; DrawnBy: Mogens Groth Nicolaisen; DocumentNumber: 3; Revision: 1.0; SheetNumber: 3; SheetTotal: 7
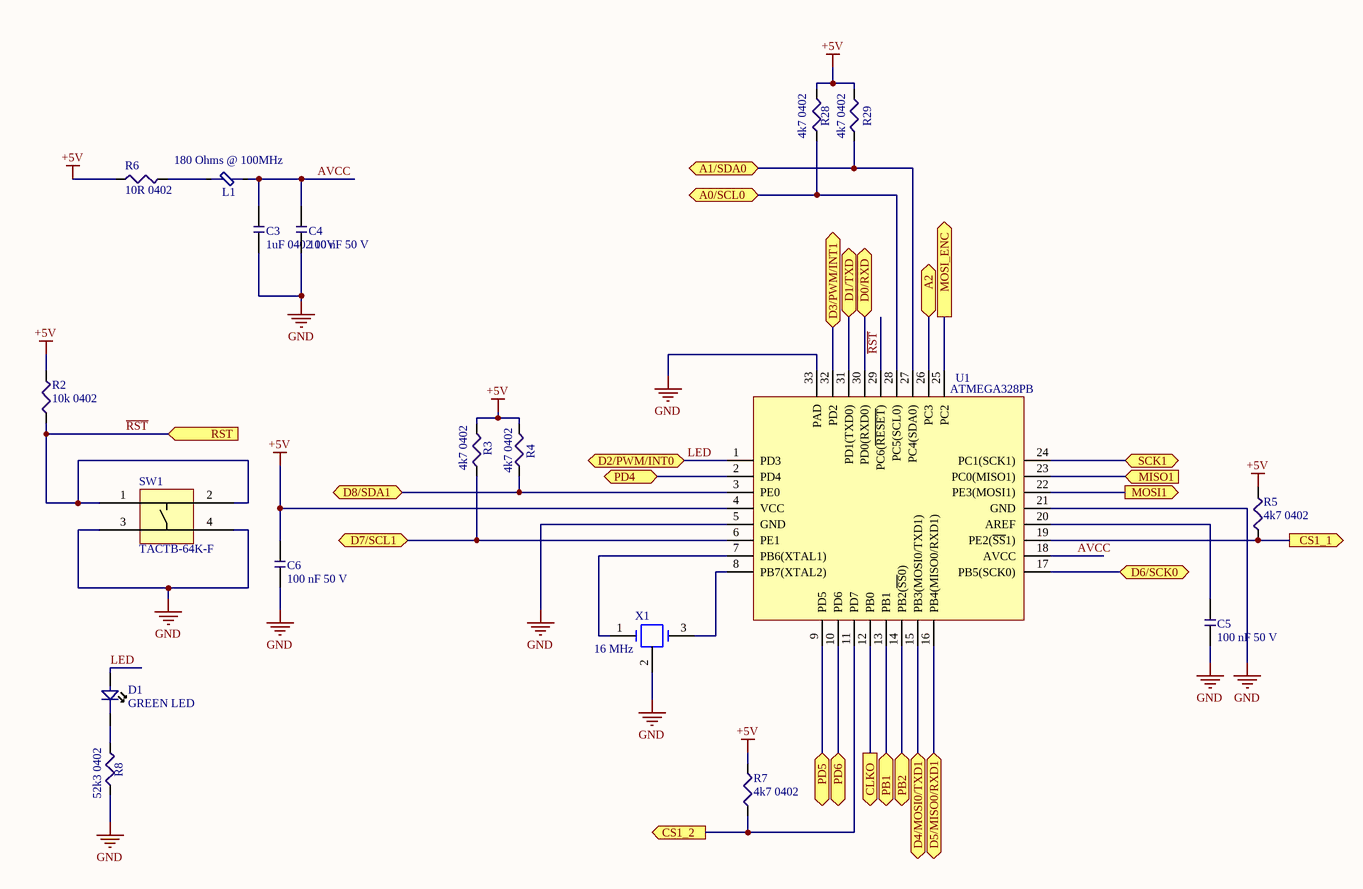
[diagram p6: MCU+IO.SchDoc]

### Parts
C3  1uF 0402 10V  [CAP_0402]
C4  100 nF 50 V  [CAP_0402]
C5  100 nF 50 V  [CAP_0402]
C6  100 nF 50 V  [CAP_0402]
D1  GREEN LED  [0402 LED]
L1  180 Ohms @ 100MHz  [IND_0603]
R2  10k 0402  [RES_0402]
R3  4k7 0402  [RES_0402]
R4  4k7 0402  [RES_0402]
R5  4k7 0402  [RES_0402]
R6  10R 0402  [RES_0402]
R7  4k7 0402  [RES_0402]
R8  52k3 0402  [RES_0402]
R28  4k7 0402  [RES_0402]
R29  4k7 0402  [RES_0402]
SW1  TACTB-64K-F  [TACTB-64K-F]
U1  ATMEGA328PB  [QFN50P500X500X90_HS-33N]
X1  16 MHz  [CSTCE16XTAL]

### Ports
A0/SCL0 (bidir), A1/SDA0 (bidir), A2 (bidir), CLKO (out), CS1_1 (out), CS1_2 (out), D0/RXD (bidir), D1/TXD (bidir), D2/PWM/INT0 (bidir), D3/PWM/INT1 (bidir), D4/MOSI0/TXD1 (bidir), D5/MISO0/RXD1 (bidir), D6/SCK0 (bidir), D7/SCL1 (bidir), D8/SDA1 (bidir), MISO1 (in), MOSI1 (out), MOSI_ENC (out), PB1 (bidir), PB2 (bidir), PD4 (bidir), PD5 (bidir), PD6 (bidir), RST (in), SCK1 (bidir)

### Nets
+5V: C6.1 R2.2 R3.2 R4.2 R5.2 R6.1 R7.2 R28.2 R29.2 U1.4(VCC)
GND: C3.1 C4.2 C5.2 C6.2 R8.1 SW1.3 SW1.4 U1.5(GND) U1.21(GND) U1.33(PAD) X1.2(GND)
~{RST}: R2.1 SW1.1 SW1.2 U1.29(PC6(~{RESET})) ; port RST
A0/SCL0: R28.1 U1.28(PC5(SCL0)) ; port A0/SCL0
A1/SDA0: R29.1 U1.27(PC4(SDA0)) ; port A1/SDA0
A2: U1.26(PC3) ; port A2
AVCC: C3.2 C4.1 L1.2 U1.18(AVCC)
CLKIN: U1.12(PB0) ; port CLKO
CS: R5.1 U1.19(PE2(~{SS}1)) ; port CS1_1
CS_ENC: R7.1 U1.11(PD7) ; port CS1_2
D0/RXD: U1.30(PD0(RXD0)) ; port D0/RXD
D1/TXD: U1.31(PD1(TXD0)) ; port D1/TXD
D3: U1.32(PD2) ; port D3/PWM/INT1
D4/MOSI0: U1.15(PB3(MOSI0/TXD1)) ; port D4/MOSI0/TXD1
D5/MISO0: U1.16(PB4(MISO0/RXD1)) ; port D5/MISO0/RXD1
D6/SCK0: U1.17(PB5(SCK0)) ; port D6/SCK0
D7/SCL1: R3.1 U1.6(PE1) ; port D7/SCL1
D8/SDA1: R4.1 U1.3(PE0) ; port D8/SDA1
DIR: U1.13(PB1) ; port PB1
ENA: U1.2(PD4) ; port PD4
LED: D1.1 U1.1(PD3) ; port D2/PWM/INT0  [project net D2]
MISO: U1.23(PC0(MISO1)) ; port MISO1
MOSI: U1.22(PE3(MOSI1)) ; port MOSI1
MOSI_ENC: U1.25(PC2) ; port MOSI_ENC
PB2: U1.14(PB2(~{SS}0)) ; port PB2
PD5: U1.9(PD5) ; port PD5
PD6: U1.10(PD6) ; port PD6
SCK: U1.24(PC1(SCK1)) ; port SCK1
NetC5_1: C5.1 U1.20(AREF)
NetD1_2: D1.2 R8.2
NetL1_1: L1.1 R6.2
NetU1_7: U1.7(PB6(XTAL1)) X1.1(OSC1)
NetU1_8: U1.8(PB7(XTAL2)) X1.3(OSC2)

### Notes on the sheet
- ON Development
- Title:
- Size:
- A3
- Drawn By:
- Date:
- Sheet
- of
- Revision:

### Library data of the parts
C3 = CMP-00032-5: 1uF 0402 10V 10% X5R; Material: Ceramic; Tolerance: 10%; Value: 1 uF; Voltage: 10 V; Capacitance: 1uF; Case/Package: 0402; Case Code (Imperial): 0402; Case Code (Metric): 1005; Contact Plating: Tin; Depth: 0.5mm; Dielectric: X5R; Height: 0.5mm; Length: 1mm; Max Operating Temperature: 85°C; Min Operating Temperature: -55°C; Mount: Surface Mount; Package Quantity: 1; Packaging: Tape and Reel; Radiation Hardening: No; Thickness: 0.022inch; Voltage Rating: 10V; Width: 0.02inch
C4-C6 = CMP-00088-2: as C11 on sheet Stepper_control; Mount: Surface Mount; Case/Package: 0402; Case Code (Imperial): 0402; Case Code (Metric): 1005; Min Operating Temperature: -55°C; Max Operating Temperature: 125°C; Capacitance: 100nF; Voltage Rating (DC): 50V; Packaging: Tape and Reel; Package Quantity: 10000; Dielectric: X7R; Termination: SMD/SMT; Length: 0.039inch; Height: 0.5mm; Width: 0.5mm; Thickness: 0.022inch; Lead Free: Lead Free; Halogen Free: Halogen Free
D1 = CMP-008-0001-2: as D2 on sheet Power
L1 = CMP-ROOT-0005-2: as L2 on sheet Stepper_control; Case/Package: 0603
R2 = CMP-001-0019-3: as R1 on sheet Main; Case/Package: 0402; Power: 1/16 W; Tolerance: 1 %; Value: 10k
R3-R5 R7 R28 R29 = CMP-001-0029-3: as R20 on sheet Main; Case/Package: 0402; Power: 1/16W; Value: 4k7
R6 = CMP-001-0033-3: as R10 on sheet Stepper_control; Case/Package: 0402; Tolerance: 1%; Value: 10R
R8 = CMP-001-0018-3: as R9 on sheet Power; Case/Package: 0402; Power: 1/16 W; Tolerance: 1 %; Value: 52k3
SW1 = CMP-013-0002-1: Microswitch TACT; SPST-NO; Positions:2; 0.05A/12VDC;; Case/Package: -; Mount: SMD; Pins: 4; RoHS: Yes; Mfg. Part No.: TACTB-64K-F
U1 = CMP-011-0001-4: IC MCU 8BIT 32KB FLASH 32TQFP; Case/Package: QFN-32; Mount: SMD; Pins: 32; RoHS: Yes
X1 = CMP-015-0002-4: CER RES 16.0000MHZ 15PF SMD; Mfg. Part Number: CSTCE16M0V53-R0; FootprintName1: CSTCE16XTAL; FootprintDescription1: CSTCE16M0V53-R0; FootprintRevisionID1: PCC-0038-1; Case/Package: -; Mount: SMD; Pins: 3; RoHS: Yes

## Nets that join several sheets
3V3: Main (PL2.9), encoder (6 pins), Power (C21.2 U4.5), Stepper_control (R23.1), USB (7 pins)
+5V: Main (PL2.8), Power (11 pins), Stepper_control (R10.2), USB (Q2.4 R27.2), MCU+IO (10 pins)
GND: Main (7 pins), encoder (6 pins), Power (13 pins), Stepper_control (24 pins), USB (21 pins), MCU+IO (11 pins)
VIN: Main (8 pins), USB (R31.1)
VIN_PROTECT: Main (Q1.4 R1.2), Power (D16.1), Stepper_control (8 pins)
~{RST}: Main (PL2.10), USB (C24.1), MCU+IO (R2.1 SW1.1 SW1.2 U1.29)
A: encoder (U3.9), Stepper_control (U5.25)
A0/SCL0: Main (PL2.3), MCU+IO (R28.1 U1.28)
A1/SDA0: Main (PL2.2), MCU+IO (R29.1 U1.27)
A2: Main (PL2.1), MCU+IO (U1.26)
B: encoder (U3.8), Stepper_control (U5.24)
CLKIN: Stepper_control (U5.2), MCU+IO (U1.12)
CS: Stepper_control (U5.3), MCU+IO (R5.1 U1.19)
CS_ENC: encoder (U3.21), MCU+IO (R7.1 U1.11)
D0/RXD: Main (PL1.1), USB (R26.2), MCU+IO (U1.30)
D1/TXD: Main (PL1.2), USB (U6.17), MCU+IO (U1.31)
D2: Main (PL1.3), MCU+IO (D1.1 U1.1)
D3: Main (PL1.4), MCU+IO (U1.32)
D4/MOSI0: Main (PL1.5), MCU+IO (U1.15)
D5/MISO0: Main (PL1.6), MCU+IO (U1.16)
D6/SCK0: Main (PL1.7), MCU+IO (U1.17)
D7/SCL1: Main (PL1.8), MCU+IO (R3.1 U1.6)
D8/SDA1: Main (PL1.9), MCU+IO (R4.1 U1.3)
DIR: Stepper_control (U5.9), MCU+IO (U1.13)
ENA: Stepper_control (U5.29), MCU+IO (U1.2)
ENCN: encoder (U3.7), Stepper_control (U5.23)
MISO: encoder (U3.12), Stepper_control (U5.7), MCU+IO (U1.23)
MOSI: Stepper_control (U5.5), MCU+IO (U1.22)
MOSI_ENC: encoder (R30.1 U3.11), MCU+IO (U1.25)
PB2: Stepper_control (U5.8), MCU+IO (U1.14)
PD5: Stepper_control (U5.11), MCU+IO (U1.9)
PD6: Stepper_control (U5.12), MCU+IO (U1.10)
SCK: encoder (U3.10), Stepper_control (U5.4), MCU+IO (U1.24)

## Assembly variants
Screw, No I2C pull-up: not fitted C36 C37 PL5 R3 R4 R25 R28 R29
Plug, No I2C pull-up: not fitted C36 C37 PL4 R3 R4 R25 R28 R29
Default: not fitted PL4 R28 R29